# EasyEDA schematic pilote_poele_2020-12-16_14-18-25.json
TITLE: Sheet_1; REV: 1.0; Date: 2020-11-13; Sheet: 1/1; Drawn By: rinty35; Company: Your Company
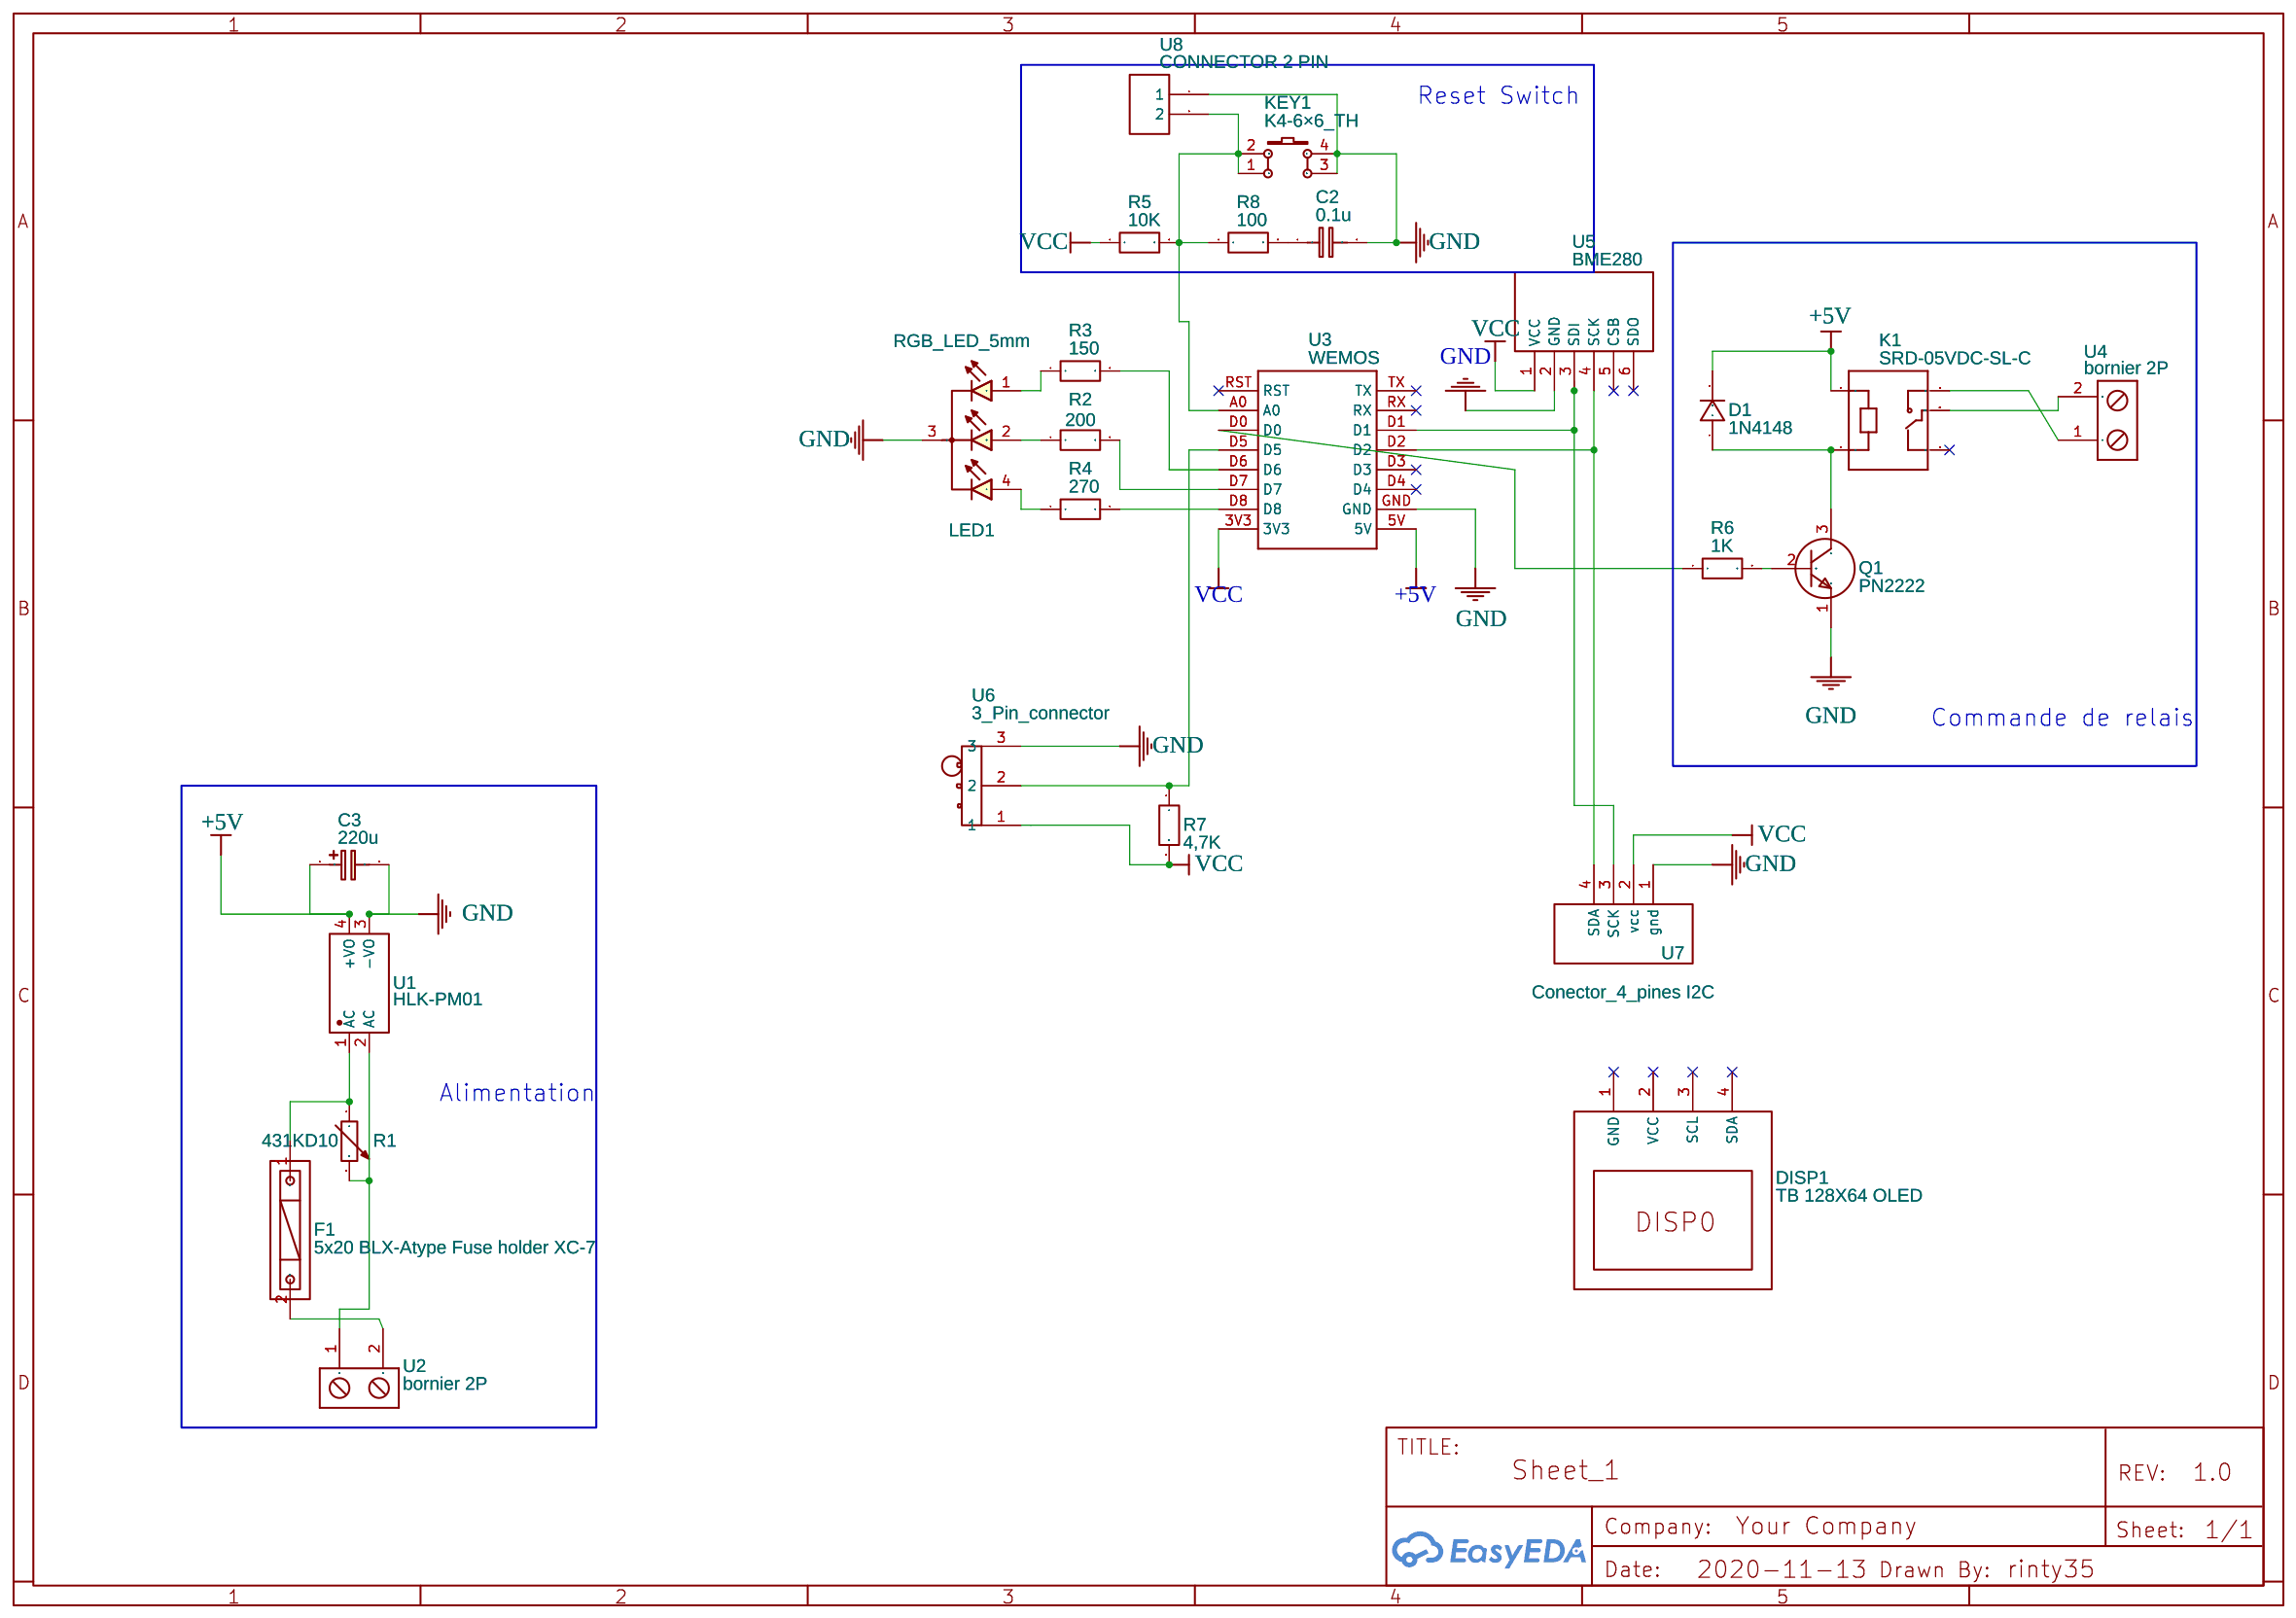
[diagram p0: schematic sheet]

## Parts
C2  0.1u  [RAD-0.1]
C3  220u  [CAP-D6.3×F2.5]
D1  1N4148  [DO-35_BD2.0-L4.0-P8.00-D0.5-FD]
DISP1  TB 128X64 OLED  [TB 128X64 OLED]
F1  5x20 BLX-Atype Fuse holder XC-7  [FUSE-TH_L22.6-W9.0]
K1  SRD-05VDC-SL-C  [RELAY_SRD-05VDC-SL-C]
KEY1  K4-6×6_TH  [KEY-TH_4P-L6.0-W6.0-P4.50-LS6.5]
LED1  RGB_LED_5mm  [RGB-5MM]
Q1  PN2222  [ONSC-TO-92-3-29-11_AM_BL]
R1  431KD10  [RES-TH_L12.5-W6.7-P7.50-D1.2-S6.30]
R2  200  [R_AXIAL-0.4]
R3  150  [R_AXIAL-0.4]
R4  270  [R_AXIAL-0.4]
R5  10K  [R_AXIAL-0.4]
R6  1K  [R_AXIAL-0.4]
R7  4,7K  [R_AXIAL-0.4]
R8  100  [R_AXIAL-0.4]
U1  HLK-PM01  [PWRM-TH_HLK-PM01]
U2  bornier 2P  [BORNIER 2P]
U3  WEMOS  [WEMOS]
U4  bornier 2P  [BORNIER 2P]
U5  BME280  [BME280 6PINS SIPPY]
U6  3_Pin_connector  [PIN 3]
U7  Conector_4_pines I2C  [SIP-2.54MM-4P-CJT-H8.54]
U8  CONNECTOR 2 PIN  [CONNECTOR 2 PIN]

## Library data of the parts
C2 = C_0603_EU: Contributor: LCEDA_Lib
C3 = CE_TH_D4.0×F1.5_EU: Contributor: LCEDA_Lib
D1 = 1N4148: Supplier: LCSC; Manufacturer: SEMTECH; Supplier Part: C14516; Contributor: LCEDA_Lib
DISP1 = TB 128X64 OLED: Contributor: timboland; sourceId: hdI0icuoG
F1 = 5x20 BLX-Atype Fuse holder XC-7: Supplier: LCSC; Manufacturer: XCFuse; image: //image.lceda.cn/szlcsc/C3131.jpg; Supplier Part: C3131
K1 = SRD-05VDC-SL-C: Contributor: Syed Hasnat Ali
KEY1 = K4-6×6_TH: Supplier: LCSC; Supplier Part: C136684; Manufacturer: 韩国韩荣; Manufacturer Part: K2-1102DP-E4SW-04; Contributor: LCEDA_Lib
LED1 = RGB_LED_5mm: Supplier: LCSC; Manufacturer: KENTO; Manufacturer Part: φ5 RGB LED; Contributor: jousterde1; Supplier Part: C32985
Q1 = PN2222: General Purpose Transistor, NPN Silicon, 3-Pin TO-92, Pb-Free, Ammo Box; Contributor: felixzhdanov
R1 = 431KD10: Supplier: LCSC; Manufacturer: Brightking; Supplier Part: C123332
R2-R6 R8 = R_AXIAL-0.5_EU: Contributor: LCEDA_Lib
R7 = R_0603_EU: Contributor: LCEDA_Lib
U1 = HLK-PM01: Supplier: LCSC; Supplier Part: C209903; Manufacturer: HI-LINK; Contributor: LCSC
U2 U4 = bornier 2P: Manufacturer Part: bornier; Contributor: Janosch_89; Supplier Part: https://fr.aliexpress.com/item/10pcs-2-Poles-2-Pin-2-54mm-0-1-PCB-Universal-Screw-Terminal-Block-Connector-Free/32556311867.html?spm=a2g0s.12269583.0.0.52167213yanoYJ
U3 = WEMOS
U5 = BME280: Contributor: David Lochlin
U6 = 3_Pin_connector: Manufacturer Part: pin 3; Contributor: dearali
U7 = Conector_4_pines: Contributor: kafunga
U8 = CONNECTOR 2 PIN: Contributor: So What!

## Nets
+5V: C3.1 D1.2 K1.A1 U1.4(+VO) U3.5V
GND: C2.2 C3.2 KEY1.3 KEY1.4 LED1.3 Q1.1(E) U1.3(-VO) U3.GND U5.2(GND) U6.3 U7.1(gnd) U8.1
VCC: R5.1 R7.2 U3.3V3 U5.1(VCC) U6.1 U7.2(vcc)
C2_1: C2.1 R8.2
D1_1: D1.1 K1.A2 Q1.3(C)
F1_2: F1.2 U2.2
LED1_1: LED1.1 R3.1
LED1_2: LED1.2 R2.1
LED1_4: LED1.4 R4.1
Net-(R6-1): R6.1 U3.D0
Net-(U3-D1): U3.D1 U5.3(SDI) U7.3(SCK)
Net-(U3-D2): U3.D2 U5.4(SCK) U7.4(SDA)
Q1_2: Q1.2(B) R6.2
U1_1: F1.1 R1.1 U1.1(AC)
U1_2: R1.2 U1.2(AC) U2.1
U3_A0: KEY1.1 KEY1.2 R5.2 R8.1 U3.A0 U8.2
U3_D5: R7.1 U3.D5 U6.2
U3_D6: R3.2 U3.D6
U3_D7: R2.2 U3.D7
U3_D8: R4.2 U3.D8
U4_1: K1.NO U4.1
U4_2: K1.COM U4.2

Not connected (* = marked no-connect by the designer): DISP1 1(GND)* 2(VCC)* 3(SCL)* 4(SDA)*; K1 NC*; U3 D3* D4* RST* RX* TX*; U5 5(CSB)* 6(SDO)*

## Notes on the sheet
- Reset Switch
- Commande de relais
- Alimentation
